# EAGLE design SwitchMatrix_(ADG888) (EAGLE 7.1.0)
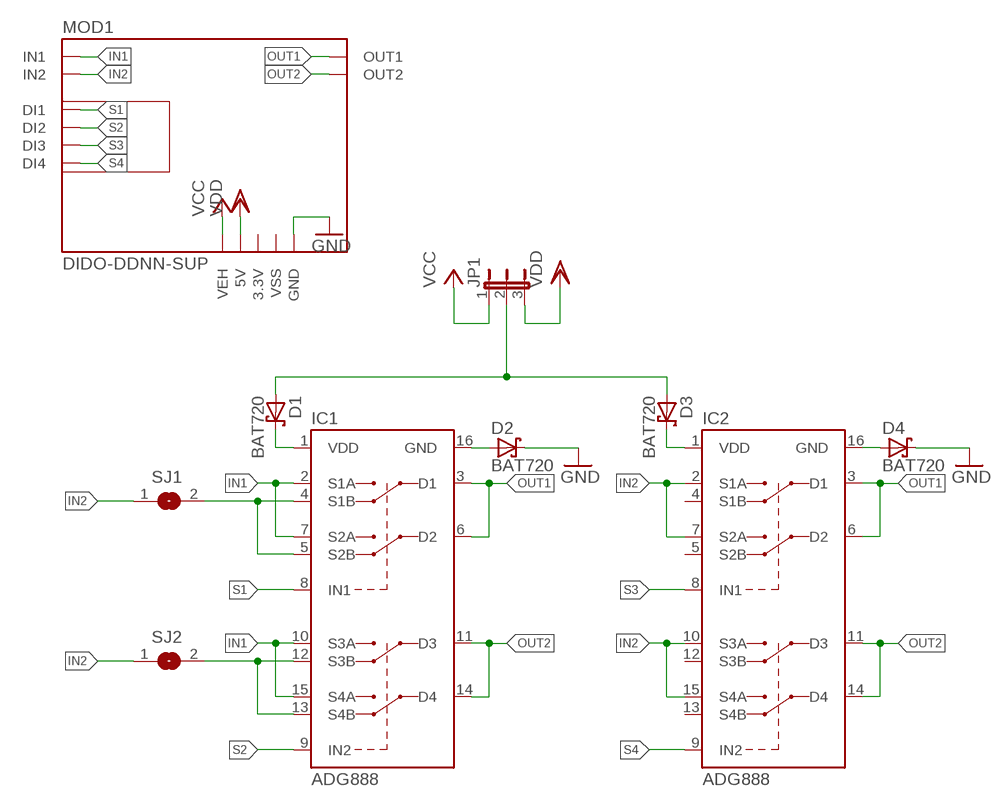
[diagram p0: schematic, sheet 1]

## Parts
D1  BAT720  BAT54  [SOT23]
D2  BAT720  BAT54  [SOT23]
D3  BAT720  BAT54  [SOT23]
D4  BAT720  BAT54  [SOT23]
IC1  ADG888  ADG888YRUZ  [TSSOP16]
IC2  ADG888  ADG888YRUZ  [TSSOP16]
JP1  JP2E  [JP2]
MOD1  DIDO-DDNN-SUP  [DIDO-DDNN-SUP]
SJ1  SJ  [SJ]
SJ2  SJ  [SJ]

## Nets
GND: D2.3(C) D4.3(C) MOD1.GND1(GND) MOD1.GND2(GND) MOD1.GND3(GND) MOD1.GND4(GND)
IN1: IC1.2(S1A) IC1.7(S2A) IC1.10(S3A) IC1.15(S4A) MOD1.IN1_1(IN1) MOD1.IN1_2(IN1) MOD1.IN1_3(IN1) MOD1.IN1_4(IN1)
IN2: IC2.2(S1A) IC2.7(S2A) IC2.10(S3A) IC2.15(S4A) MOD1.IN2_1(IN2) MOD1.IN2_2(IN2) MOD1.IN2_3(IN2) MOD1.IN2_4(IN2) SJ1.1 SJ2.1
N$1: IC1.4(S1B) IC1.5(S2B) SJ1.2
N$2: IC1.12(S3B) IC1.13(S4B) SJ2.2
N$3: D2.1(A) IC1.16(GND)
N$4: D1.3(C) IC1.1(VDD)
N$5: D3.3(C) IC2.1(VDD)
N$6: D4.1(A) IC2.16(GND)
N$7: D1.1(A) D3.1(A) JP1.2
OUT1: IC1.3(D1) IC1.6(D2) IC2.3(D1) IC2.6(D2) MOD1.OUT1_1(OUT1) MOD1.OUT1_2(OUT1) MOD1.OUT1_3(OUT1) MOD1.OUT1_4(OUT1)
OUT2: IC1.11(D3) IC1.14(D4) IC2.11(D3) IC2.14(D4) MOD1.OUT2_1(OUT2) MOD1.OUT2_2(OUT2) MOD1.OUT2_3(OUT2) MOD1.OUT2_4(OUT2)
S1: IC1.8(IN1) MOD1.DI1
S2: IC1.9(IN2) MOD1.DI2
S3: IC2.8(IN1) MOD1.DI3
S4: IC2.9(IN2) MOD1.DI4
VCC: JP1.1 MOD1.VEH
VDD: JP1.3 MOD1.5V
Unconnected: IC2.4(S1B) IC2.5(S2B) IC2.12(S3B) IC2.13(S4B)

## Power pins joined to a net without a drawn wire
3.3V: MOD1.3.3V
VSS: MOD1.VSS

## Library data of the parts
D1-D4 = diode:BAT54: Schottky Diodes Source: Fairchild .. BAT54.pdf
IC1 IC2 = ADG888:ADG888YRUZ
JP1 = Jumper_mod:JP2E: JUMPER
MOD1 = AllModules:DIDO-DDNN-SUP
SJ1 SJ2 = jumper:SJ: SMD solder JUMPER

## Board
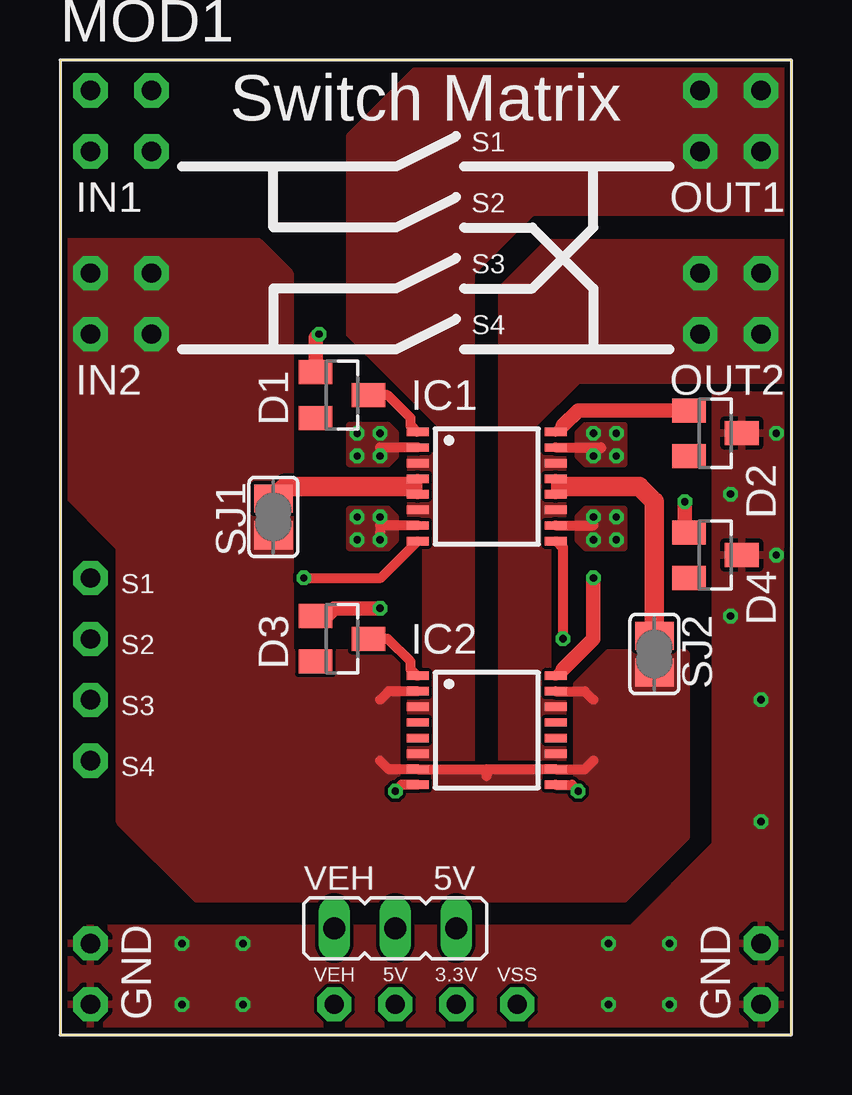
[diagram p1: board, top side]
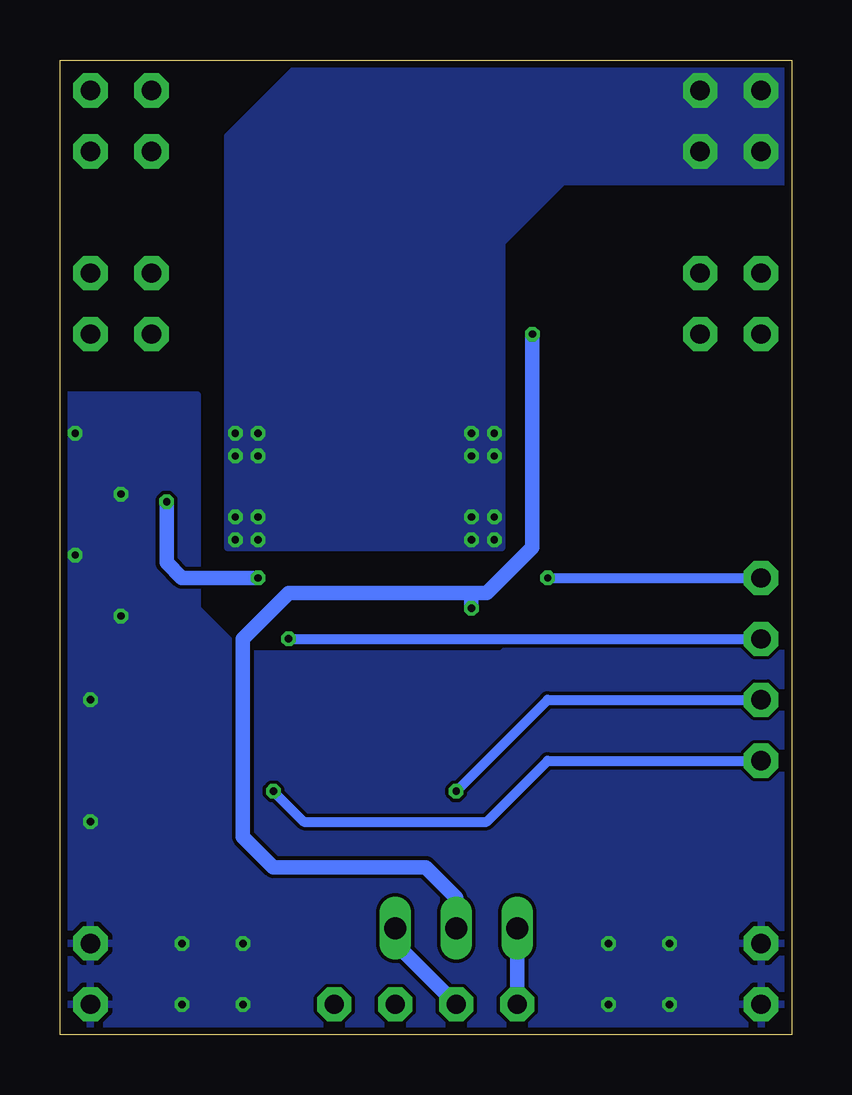
[diagram p2: board, bottom side, seen from below]

Size 30.48 x 40.64 mm. Coordinates in mm from the lower left corner, seen from the top.
Outline: 0,0 30.46,0 30.48,40.64 0,40.64 0,0
Copper layers (1*16): Top 0.035mm / dielectric 1.5mm / Bottom 0.035mm
Design rules "PCB-POOL Standard": minimum track width 0.15mm, minimum drill 0.3mm, track to track 0.15mm, track to pad 0.15mm, pad to pad 0.15mm, via to via 0.15mm, smd to smd 0.15mm, copper to edge 0.3mm, drill to drill 0.2mm, minimum pad ring 0.2mm, minimum via ring 0.15mm, stop-mask expansion 0.075mm, vias tented up to drill 0mil, thermal gap 0.2mm

### Footprints (pad centres in the part's own frame; a part is rotated, then mirrored left to right if it is on the bottom)
SOT23 = smd 1 x 1.4: 1 -0.95,-1.1; 2 0.95,-1.1; 3 0,1.1
TSSOP16 = smd 0.9 x 0.35: 1 -2.875,2.275; 2 -2.875,1.625; 3 -2.875,0.975; 4 -2.875,0.325; 5 -2.875,-0.325; 6 -2.875,-0.975; 7 -2.875,-1.625; 8 -2.875,-2.275; 9 2.875,-2.275; 10 2.875,-1.625; 11 2.875,-0.975; 12 2.875,-0.325; 13 2.875,0.325; 14 2.875,0.975; 15 2.875,1.625; 16 2.875,2.275
JP2 = drill 0.914 long: 1 -2.54,0; 2 0,0; 3 2.54,0
DIDO-DDNN-SUP = drill 0.8 pad 1.422 octagon: 3.3V 15.24,-38.1; 5V 12.7,-38.1; DI1 0,-20.32; DI2 0,-22.86; DI3 0,-25.4; DI4 0,-27.94; GND1 0,-38.1; GND2 0,-35.56; GND3 27.94,-35.56; GND4 27.94,-38.1; IN1_1 0,0; IN1_2 0,-2.54; IN1_3 2.54,0; IN1_4 2.54,-2.54; IN2_1 0,-7.62; IN2_2 0,-10.16; IN2_3 2.54,-7.62; IN2_4 2.54,-10.16; OUT1_1 25.4,0; OUT1_2 25.4,-2.54; OUT1_3 27.94,0; OUT1_4 27.94,-2.54; OUT2_1 25.4,-7.62; OUT2_2 25.4,-10.16; OUT2_3 27.94,-7.62; OUT2_4 27.94,-10.16; VEH 10.16,-38.1; VSS 17.78,-38.1
SJ = smd 1.168 x 1.6: 1 -0.762,0; 2 0.762,0

### Placement (x,y rotation side)
D1  11.75,26.67 270 top
D2  27.3,25.08 270 top
D3  11.75,16.51 270 top
D4  27.3,20 270 top
IC1  17.78,22.86 0 top
IC2  17.78,12.7 0 top
JP1  13.97,4.45 0 top
MOD1  1.27,39.37 0 top
SJ1  8.89,21.59 90 top
SJ2  24.77,15.88 90 top

### Tracks (layer width: path | path; a pad name or v marks a point on that pad's centre or on a via)
GND  (via drill 0.3)
  other vias: 25.4,1.27 5.08,1.27 27.94,22.54 29.84,25.08 29.84,20 27.94,17.46 25.4,3.81 5.08,3.81 22.86,3.81 22.86,1.27 7.62,3.81 7.62,1.27 29.21,8.89 29.21,13.97
  pour Top: 27.3,26.67 30.48,26.67 30.48,0 0,0 0,4.45 23.81,4.45 27.3,7.94
  pour Bottom: 0,33.66 8.26,33.66 10.16,31.75 10.16,17.78 12.06,15.88 22.86,15.88 24.77,17.78 24.77,26.67 30.48,26.67 30.48,0 0,0
IN1  (via drill 0.3)
  Top 0.406: IC1.2 13.34,24.48 v13.34,24.13 | IC1.7 13.34,21.23 13.34,20.96 | IC1.15 22.54,24.48 22.54,24.45 | IC1.10 22.23,21.23 v22.23,21.59
  other vias: 12.38,24.13 12.38,25.08 13.34,25.08 13.34,21.59 12.38,21.59 12.38,20.64 13.34,20.64 22.23,25.08 22.23,24.13 23.18,24.13 23.18,25.08 22.23,20.64 23.18,20.64 23.18,21.59
  pour Bottom (no thermals): 0,40.64 20.32,40.64 23.5,37.47 23.5,20.32 12.06,20.32 12.06,33.02 9.53,35.56 0,35.56
  pour Top: 12.06,25.4 13.65,25.4 13.97,25.08 13.97,24.13 13.65,23.81 12.06,23.81
  pour Top: 12.06,21.91 13.65,21.91 13.97,21.59 13.97,20.64 13.65,20.32 12.06,20.32
  pour Top: 23.5,23.81 21.91,23.81 21.59,24.13 21.59,25.08 21.91,25.4 23.5,25.4
  pour Top: 23.5,20.32 21.91,20.32 21.59,20.64 21.59,21.59 21.91,21.91 23.5,21.91
IN2
  Top 0.406: 17.78,11.07 IC2.7 13.69,11.07 13.34,11.43 | 17.78,11.07 IC2.10 21.87,11.07 22.23,11.43 | 17.78,11.07 17.78,10.8 | IC2.2 13.69,14.32 13.34,13.97 | IC2.15 21.87,14.32 22.23,13.97
  pour Top (no thermals): 0,33.02 8.26,33.02 9.53,31.75 9.53,15.88 13.97,15.88 13.97,10.8 21.59,10.8 21.59,14.61 22.86,15.88 26.04,15.88 26.04,8.26 23.5,5.72 5.71,5.72 2.54,8.89 2.54,20.32 0,22.86
N$1
  Top 0.305: 14.61,22.86 14.9,22.56 IC1.5
  Top 0.406: IC1.5 IC1.4
  Top 0.813: 14.61,22.86 9.4,22.86 SJ1.2
N$2
  Top 0.305: IC1.12 20.95,22.84 20.95,22.86
  Top 0.406: IC1.13 IC1.12
  Top 0.813: 20.95,22.86 24.13,22.86 24.77,22.23 SJ2.2
N$3
  Top 0.406: IC1.16 20.92,25.4 20.95,25.4 | 21.59,26.04 21.59,26.03
  Top 0.61: 20.95,25.4 21.59,26.04 | 21.59,26.03 D2.1
N$4
  Top 0.406: IC1.1 14.87,25.13 14.61,25.4 14.61,25.72 13.65,26.67 D1.3
N$5
  Top 0.406: IC2.1 14.87,14.98 14.61,15.24 14.61,15.56 13.65,16.51 D3.3
N$6  (via drill 0.3)
  Top 0.406: 20.95,15.24 20.92,15.24 IC2.16
  Top 0.61: v22.23,19.05 22.23,16.51 20.95,15.24 | v26.04,22.23 26.04,21.12 D4.1
  Bottom 0.61: v22.23,19.05 25.4,19.05 26.04,19.69 v26.04,22.23
N$7  (via drill 0.3)
  Top 0.61: D1.1 10.65,29.06 v10.79,29.21 | D3.1 11.11,17.46 11.43,17.78 v13.34,17.78
  Bottom 0.61: v10.79,29.21 10.79,20.32 12.7,18.41 13.34,18.41 | 13.34,18.41 20.95,18.41 22.86,16.51 22.86,8.26 21.59,6.98 15.24,6.98 13.97,5.72 JP1.2 | v13.34,17.78 13.34,18.41
OUT1
  pour Top (no thermals): 30.48,34.29 30.48,40.64 15.24,40.64 12.06,37.47 12.06,29.21 15.88,25.4 15.88,24.13 14.61,24.13 14.61,21.59 15.24,21.59 15.24,13.97 14.61,13.97 14.61,11.43 17.14,11.43 17.14,31.75 19.68,34.29
OUT2
  pour Top (no thermals): 30.48,27.3 30.48,33.02 20.32,33.02 18.41,31.12 18.41,11.43 20.95,11.43 20.95,13.97 20.32,13.97 20.32,21.59 20.95,21.59 20.95,24.13 19.68,24.13 19.68,25.4 21.59,27.3
S1  (via drill 0.3)
  Top 0.406: v10.16,19.05 13.37,19.05 IC1.8
  Bottom 0.406: v10.16,19.05 MOD1.DI1
S2  (via drill 0.3)
  Top 0.406: IC1.9 20.69,20.59 20.95,20.32 v20.95,16.51
  Bottom 0.406: v20.95,16.51 MOD1.DI2
S3  (via drill 0.3)
  Top 0.406: IC2.8 14.23,10.43 v13.97,10.16
  Bottom 0.406: v13.97,10.16 10.16,13.97 MOD1.DI3
S4  (via drill 0.3)
  Top 0.406: IC2.9 21.32,10.43 v21.59,10.16
  Bottom 0.406: v21.59,10.16 20.32,8.89 12.7,8.89 10.16,11.43 MOD1.DI4
VCC
  Bottom 0.61: JP1.1 MOD1.VEH
VDD
  Bottom 0.61: JP1.3 16.51,3.81 MOD1.5V

### Text on the board
tPlace: S1 | S2 | S3 | S4 | S1 | S2 | S3 | S4
tNames: Switch Matrix | VEH | 5V
bStop: by Jan Kokert / 12.05.2015